# Altium schematic sheet Main.SchDoc
size A4; SheetNumber: 1; SheetTotal: 6
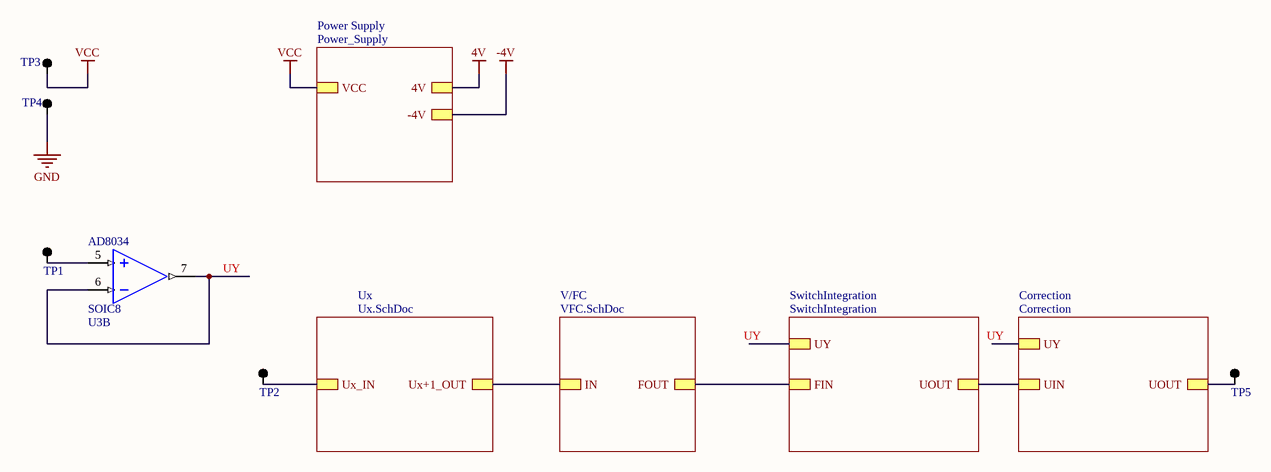
[diagram p0: Main.SchDoc]

## Parts
TP1  Single pin  [TP_1PIN]  (value not drawn)  (no BOM)
TP2  Single pin  [TP_1PIN]  (value not drawn)  (no BOM)
TP3  Single pin  [TP_1PIN]  (value not drawn)  (no BOM)
TP4  Single pin  [TP_1PIN]  (value not drawn)  (no BOM)
TP5  Single pin  [TP_1PIN]  (value not drawn)  (no BOM)
U3  value AD8034  SCH_Footprint: SOIC8  [SO8]  (hidden comment: A2_AD8034)  (part B of 2)

## Sub-sheets
Correction = Correction: UIN, UOUT, UY
Power Supply = Power_Supply: VCC, 4V, -4V
SwitchIntegration = SwitchIntegration: FIN, UY, UOUT
Ux = Ux.SchDoc: Ux_IN, Ux+1_OUT
V/FC = VFC.SchDoc: FOUT, IN

## Nets
4V: sheet Power Supply/4V
-4V: sheet Power Supply/-4V
GND: TP4.1(TP)
VCC: TP3.1(TP) ; sheet Power Supply/VCC
UY: U3.6(IN-2) U3.7(OUT2) ; sheet SwitchIntegration/UY, sheet Correction/UY
NetTP1_1: TP1.1(TP) U3.5(IN+2)
NetTP2_1: TP2.1(TP) ; sheet Ux/Ux_IN
NetTP5_1: TP5.1(TP) ; sheet Correction/UOUT
(unnamed): sheet V/FC/FOUT, sheet SwitchIntegration/FIN
(unnamed): sheet V/FC/IN, sheet Ux/Ux+1_OUT
(unnamed): sheet SwitchIntegration/UOUT, sheet Correction/UIN

## Notes on the sheet
- Name:
- Author:
- Project:
- Revision:
- Date:

## Library data of the parts
TP1-TP5 = TP_1PIN: Testpoint; Value: -; SCH_Footprint: Single; Part Number: TP_1PIN; HelpURL: -; Manufacturer: -; Manufacturer Part Number: -; Supplier 1: TME; Supplier 2: RS Components; Supplier 3: Farnell; Supplier 4: Mouser; Supplier 5: Digi-Key; Supplier 6: LCSC; Supplier 7: -; Supplier Part Number 7: -